# EAGLE design Dolgin_ATTinyV5 (EAGLE 9.4.2)
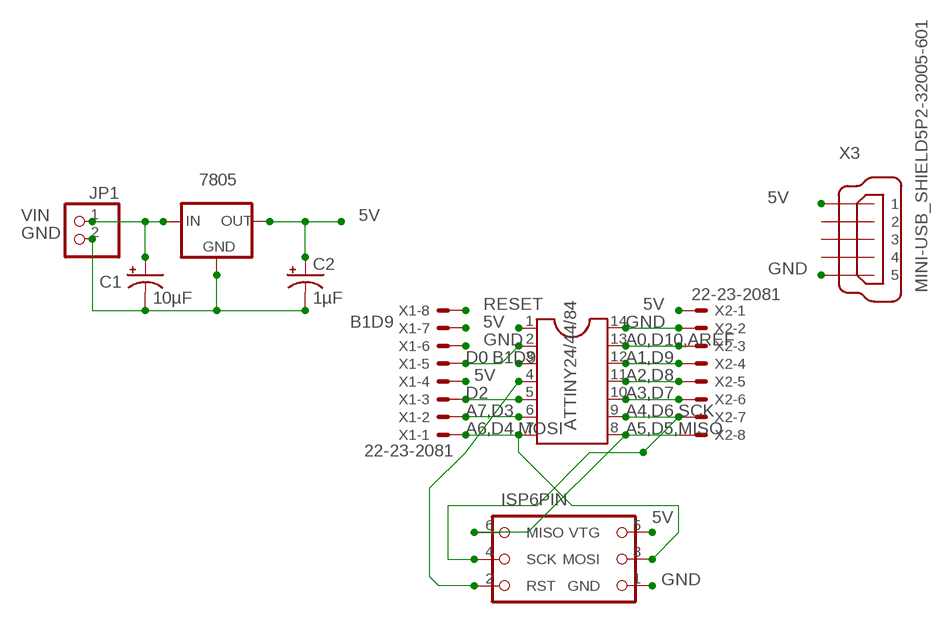
[diagram p0: schematic, sheet 1]

## Parts
7805  LM78XX  [78XXL]
ATTINY24/44/84  DIL14  [DIL14]
C1  10µF  CAPACITOR_POLARIZED  [CPOL-RADIAL-2.5MM-5MM]
C2  1µF  CAPACITOR_POLARIZED  [CPOL-RADIAL-2.5MM-5MM]
H1  ISP_HEADER  [ICSP]
JP1  PINHD-1X2  [1X02]
X1  22-23-2081  [22-23-2081]
X2  22-23-2081  [22-23-2081]
X3  MINI-USB_SHIELD5P2-32005-601  [32005-601]

## Nets
5V: 7805.OUT ATTINY24/44/84.1 C2.1(+) H1.5(VTG) X1.4 X2.1 X3.1
A0,D10,AREF: ATTINY24/44/84.13 X2.3
A1,D9: ATTINY24/44/84.12 X2.4
A2,D8: ATTINY24/44/84.11 X2.5
A3,D7: ATTINY24/44/84.10 X2.6
A4,D6,SCK: ATTINY24/44/84.9 H1.4(SCK) X2.7
A5,D5,MISO: ATTINY24/44/84.8 H1.6(MISO) X2.8
A6,D4,MOSI: ATTINY24/44/84.7 H1.3(MOSI) X1.1
A7,D3: ATTINY24/44/84.6 X1.2
B1D9: ATTINY24/44/84.3 X1.7
D0: ATTINY24/44/84.2 X1.5
D2: ATTINY24/44/84.5 X1.3
GND: 7805.GND ATTINY24/44/84.14 C1.2(-) C2.2(-) H1.1(GND) JP1.2 X1.6 X2.2 X3.5
RESET: ATTINY24/44/84.4 H1.2(RST) X1.8
VIN: 7805.IN C1.1(+) JP1.1
Unconnected: X3.2 X3.3 X3.4 X3.M1(S1) X3.M2(S2)

## Library data of the parts
7805 = ACES_THT:LM78XX: 1+ A Positive Voltage Regulators 5V Example: LM7805 <https://media.digikey.com/pdf/Data%20Sheets/ON%20Semiconductor%20PDFs/MC7800(A,AE),NCV7800.pdf>
ATTINY24/44/84 = ic-package:DIL14: Dual In Line / Socket
C1 C2 = ACES_THT:CAPACITOR_POLARIZED
H1 = ACES_THT:ISP_HEADER: No more excuses for getting these lines crossed!
JP1 = pinhead:PINHD-1X2: PIN HEADER
X1 X2 = con-molex:22-23-2081: .100" (2.54mm) Center Header - 8 Pin; MF: MOLEX; MPN: 22-23-2081; OC_FARNELL: 1756826; OC_NEWARK: 01C7592
X3 = con-cypressindustries:MINI-USB_SHIELD5P2-: MINI USB-B R/A DIP 5pol. Source: www.cypressindustries.com; OC_FARNELL: unknown; OC_NEWARK: unknown

## Board
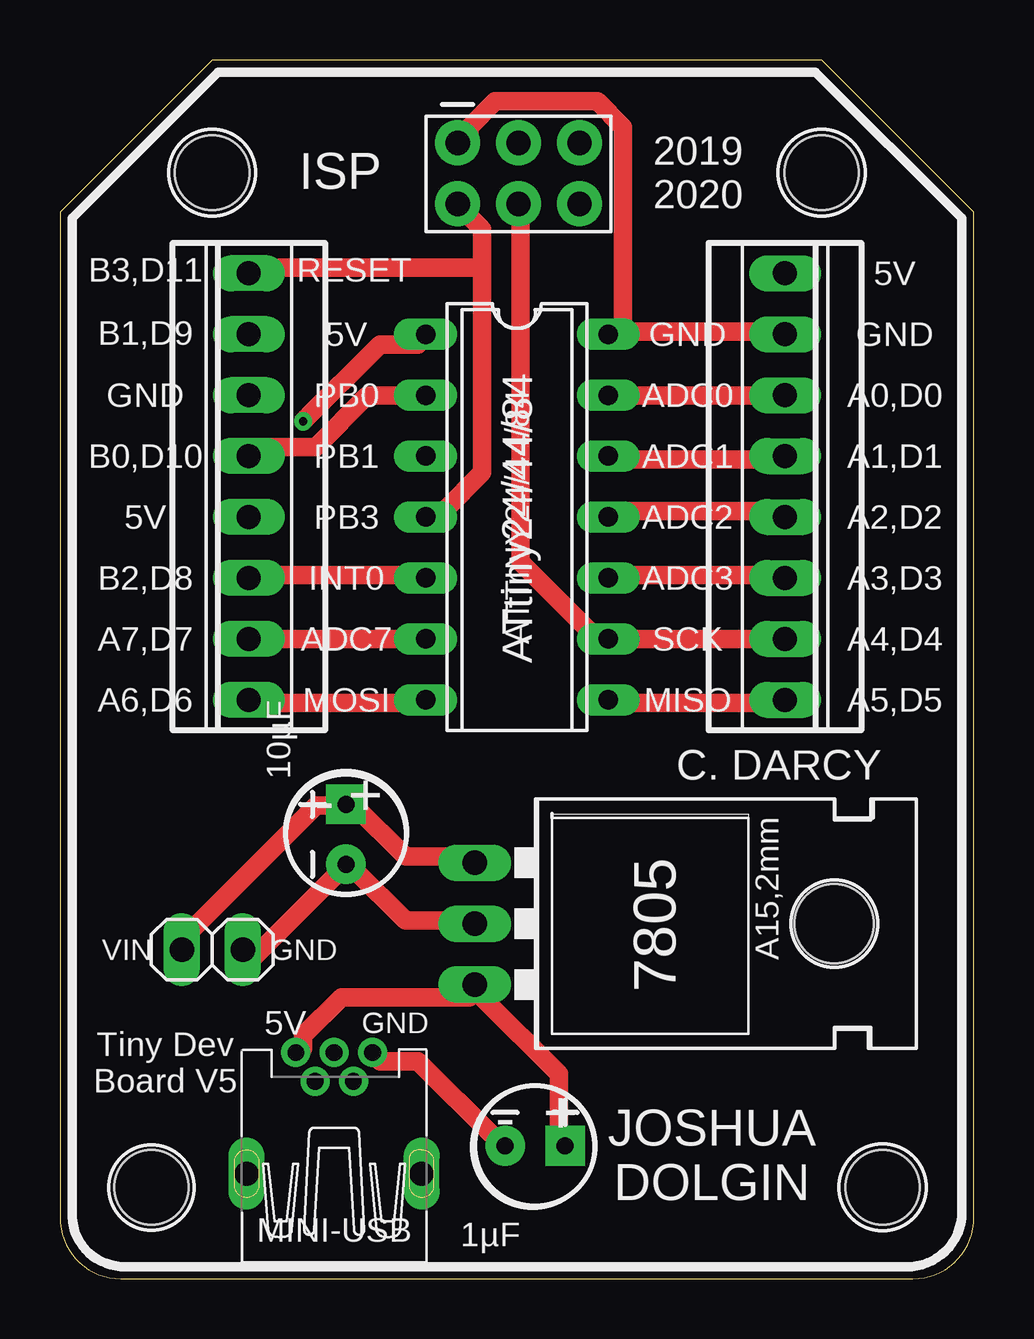
[diagram p1: board, top side]
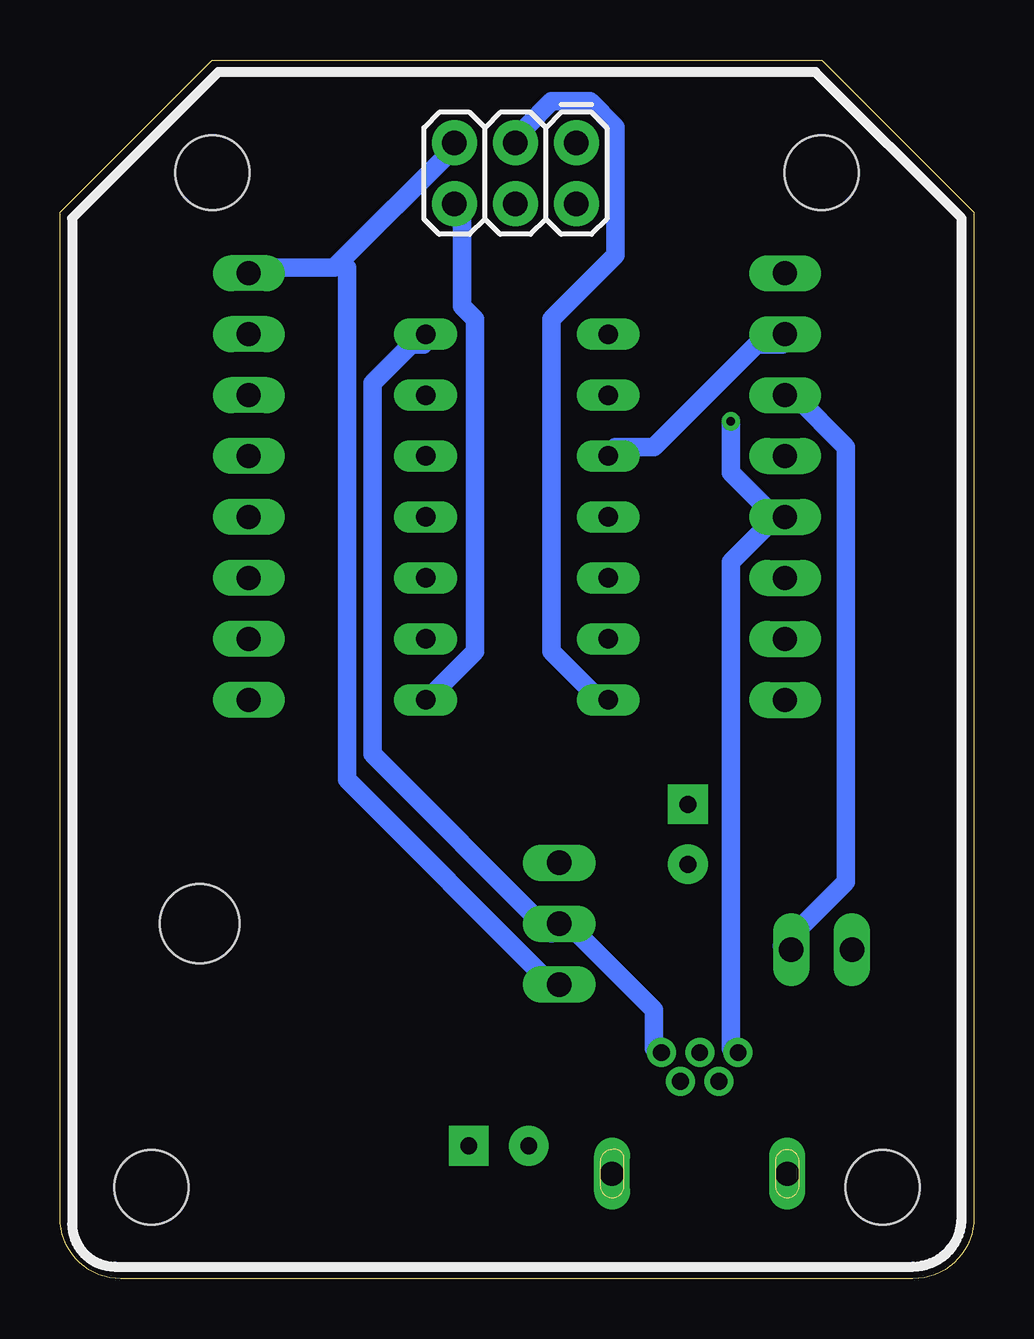
[diagram p2: board, bottom side, seen from below]

Size 38.1 x 50.8 mm. Coordinates in mm from the lower left corner, seen from the top.
Outline: 0,44.45 0,2.54 arc90 2.54,0 35.56,0 arc90 38.1,2.54 38.1,44.45 31.75,50.8 6.35,50.8 0,44.45
Copper layers (1*16): Top 0.035mm / dielectric 1.5mm / Bottom 0.035mm
Design rules "default *": minimum track width 30mil, minimum drill 0.35mm, track to track 12mil, track to pad 12mil, pad to pad 12mil, via to via 12mil, smd to smd 6mil, copper to edge 40mil, drill to drill 6mil, minimum pad ring 10mil, minimum via ring 8mil, stop-mask expansion 4mil, vias tented up to drill 0mil, thermal gap 10mil
Holes 3.1 mm at 34.29,3.81 3.81,3.81 6.35,46.1 31.75,46.1

### Footprints (pad centres in the part's own frame; a part is rotated, then mirrored left to right if it is on the bottom)
78XXL = drill 1.016 long: GND 0,-3.81; IN -2.54,-3.81; OUT 2.54,-3.81 | hole 3.302: 0,11.176
DIL14 = drill 0.813 long: 1 -7.62,-3.81; 2 -5.08,-3.81; 3 -2.54,-3.81; 4 0,-3.81; 5 2.54,-3.81; 6 5.08,-3.81; 7 7.62,-3.81; 8 7.62,3.81; 9 5.08,3.81; 10 2.54,3.81; 11 0,3.81; 12 -2.54,3.81; 13 -5.08,3.81; 14 -7.62,3.81
CPOL-RADIAL-2.5MM-5MM = drill 0.7 pad 1.651 square: 1 1.25,0 | drill 0.7 pad 1.651: 2 -1.25,0
ICSP = drill 1.016 pad 1.88: 1 0,0; 2 0,2.54; 3 2.54,0; 4 2.54,2.54; 5 5.08,0; 6 5.08,2.54
1X02 = drill 1.016 long: 1 -1.27,0; 2 1.27,0
22-23-2081 = drill 1 long: 1 -8.89,0; 2 -6.35,0; 3 -3.81,0; 4 -1.27,0; 5 1.27,0; 6 3.81,0; 7 6.35,0; 8 8.89,0
32005-601 = drill 0.7 pad 1.016: 1 2.825,1.6; 2 1.625,0.8; 3 2.825,0; 4 1.625,-0.8; 5 2.825,-1.6 | drill 1 pad 1.422 long: M1 -2.225,3.65; M2 -2.225,-3.65

### Placement (x,y rotation side)
7805  21.1,14.8 270 top
ATTINY24/44/84  19.05,31.75 270 top
C1  11.92,18.52 90 top
C2  19.81,5.54 0 top
H1  16.58,47.34 180 bottom
JP1  6.35,13.72 0 top
U$1  [ACES_LOGO_SMALL]  4.32,19.3 0 top
X1  7.87,33.02 90 top
X2  30.23,33.02 270 top
X3  11.43,6.6 90 top

### Tracks (layer width: path | path; a pad name or v marks a point on that pad's centre or on a via)
5V  (via drill 0.35)
  Top 0.762: v10.13,35.74 13.34,38.94 14.94,38.94 ATTINY24/44/84.1 | X3.1 10.13,9.6 10.13,10.13 11.73,11.73 17.07,11.73 7805.OUT 17.6,11.73 20.8,8.53 20.8,5.87 C2.1
  Bottom 0.762: 26.4,42.41 21.87,46.94 H1.5 | 26.4,42.41 26.67,42.14 29.87,42.14 X2.1 | v10.13,35.74 10.13,33.6 8,31.47 X1.4 8.53,31.47 10.13,29.87 10.13,9.6 X3.1 | 26.4,42.41 26.14,42.14 26.14,20.8 17.6,12.27 7805.OUT
A0,D10,AREF
  Top 0.762: ATTINY24/44/84.13 22.94,36.8 29.87,36.8 X2.3
A1,D9
  Top 0.762: ATTINY24/44/84.12 22.94,34.14 29.87,34.14 X2.4
A2,D8
  Top 0.762: ATTINY24/44/84.11 22.94,32 29.87,32 X2.5
A3,D7
  Top 0.762: ATTINY24/44/84.10 22.94,29.34 29.87,29.34 X2.6
A4,D6,SCK
  Top 0.762: X2.7 ATTINY24/44/84.9 22.4,26.67 19.2,29.87 19.2,44.27 H1.4
A5,D5,MISO
  Top 0.762: ATTINY24/44/84.8 22.94,24 29.87,24 X2.8
  Bottom 0.762: H1.6 21.34,44.27 21.34,40.54 20.8,40.01 20.8,26.14 22.4,24.54 ATTINY24/44/84.8
A6,D4,MOSI
  Top 0.762: ATTINY24/44/84.7 14.94,24 8,24 X1.1
  Bottom 0.762: H1.3 18.67,47.47 18.67,48.01 17.6,49.07 16,49.07 14.94,48.01 14.94,42.67 17.6,40.01 17.6,26.14 15.47,24 ATTINY24/44/84.7
A7,D3
  Top 0.762: X1.2 ATTINY24/44/84.6
B1D9
  Bottom 0.762: ATTINY24/44/84.3 14.94,34.67 13.34,34.67 9.07,38.94 8,38.94 X1.7
D0
  Top 0.762: ATTINY24/44/84.2 14.94,36.8 12.8,36.8 10.67,34.67 8,34.67 X1.5
D2
  Top 0.762: ATTINY24/44/84.5 14.94,29.34 8,29.34 X1.3
GND
  Top 0.762: 23.47,39.47 29.87,39.47 X2.2 | 23.47,39.47 22.94,39.47 ATTINY24/44/84.14 23.47,39.47 | 23.47,39.47 23.47,48.01 22.4,49.07 18.14,49.07 17.07,48.01 17.07,47.47 H1.1 | X3.5 13.34,9.07 14.94,9.07 18.14,5.87 C2.2 | 7805.GND 17.07,14.94 14.4,14.94 12.27,17.07 C1.2 11.73,17.07 8,13.34 JP1.2
  Bottom 0.762: X1.6 7.47,36.8 5.33,34.67 5.33,16.54 8,13.87 JP1.2 | X3.5 13.34,9.6 13.34,11.2 17.07,14.94 7805.GND 17.6,14.4 25.07,21.87 25.07,37.34 23.47,38.94 22.94,38.94 ATTINY24/44/84.14
RESET
  Top 0.762: 17.6,42.14 17.6,43.74 17.07,44.27 H1.2 | 17.6,42.14 17.6,33.6 16,32 15.47,32 ATTINY24/44/84.4 | 17.6,42.14 8,42.14 X1.8
VIN
  Top 0.762: JP1.1 5.33,13.87 5.33,14.4 10.67,19.74 11.73,19.74 C1.1 12.27,19.74 14.4,17.6 17.07,17.6 7805.IN

### Text on the board
_tsilk: 2019 / 2020 | ISP | B3,D11 | RESET | 5V | B1,D9 | 5V | GND | GND | GND | PB0 | ADC0 | A0,D0 | B0,D10 | PB1 | ADC1 | A1,D1 | 5V | PB3 | ATtiny24/44/84 | ADC2 | A2,D2 | B2,D8 | INT0 | ADC3 | A3,D3 | A7,D7 | ADC7 | SCK | A4,D4 | A6,D6 | MOSI | MISO | A5,D5 | C. DARCY | - | + | VIN | GND | 5V | GND | Tiny Dev / Board V5 | - | + | JOSHUA / DOLGIN | MINI-USB